# Altium project PCB_Project.PrjPcb
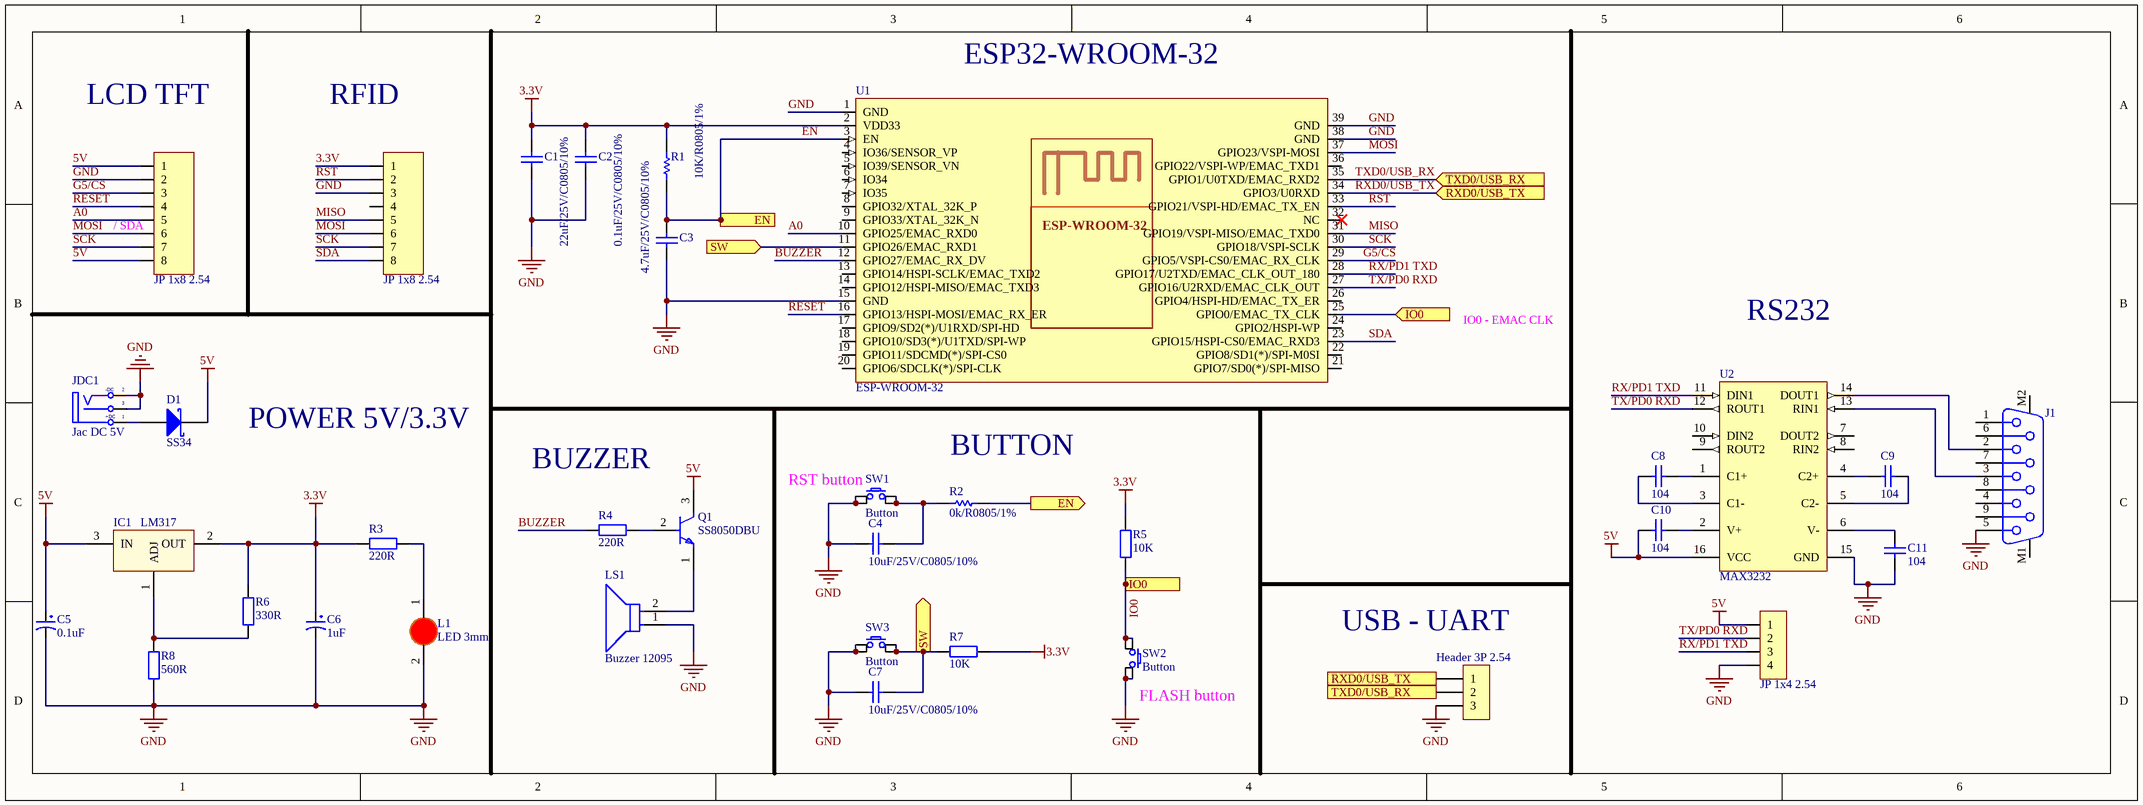
[diagram p0: Sheet1.SchDoc]
1 sheet, 35 parts. Net scope: flat (ports and power ports of the same name join across sheets).
Board file: PCB1.PcbDoc

## Sheet Sheet1.SchDoc
size 401 x 149 mm; SheetNumber: 1; SheetTotal: 1

### Parts
C1  22uF/25V/C0805/10%  [CAP_CERA_C2012(CC0805INCH)]
C2  0.1uF/25V/C0805/10%  [CAP_CERA_C2012(CC0805INCH)]
C3  4.7uF/25V/C0805/10%  [CAP_CERA_C2012(CC0805INCH)]
C4  10uF/25V/C0805/10%  [CAP_CERA_C2012(CC0805INCH)]
C5  0.1uF  [CP1/2]
C6  1uF  [CP1/2]
C7  10uF/25V/C0805/10%  [CAP_CERA_C2012(CC0805INCH)]
C8  104  [tu 0805]
C9  104  [tu 0805]
C10  104  [tu 0805]
C11  104  [tu 0805]
D1  SS34  [SS14]
H1  Header 3P 2.54  [XH2.54M-3]
IC1  LM317  [QTO-220]
J1  618009231321  [618009231321]  (value not drawn)
JDC1  Jac DC 5V  [DC-IN]
JP1  JP 1x8 2.54  [JP 1x8 DT]
JP2  JP 1x8 2.54  [JP 1x8 DT]
JP3  JP 1x4 2.54  [JP 1x4 CT]
L1  LED 3mm  [LED-3MM-RED]
LS1  Buzzer 12095  [FP-MCKPX-G1203A-K4056-MFG]
Q1  SS8050DBU  [FP-135AN-MFG]
R1  10K/R0805/1%  [Res 0805 SMD]
R2  0k/R0805/1%  [Res 0805 SMD]
R3  220R  [tro vach 1/4w]
R4  220R  [tro vach 1/4w]
R5  10K  [tro vach 1/4w]
R6  330R  [tro vach 1/4w]
R7  10K  [tro vach 1/4w]
R8  560R  [tro vach 1/4w]
SW1  Button  [SW/4/06MM]
SW2  Button  [SW/4/06MM]
SW3  Button  [SW/4/06MM]
U1  ESP-WROOM-32  [ESP32 WROOM]
U2  MAX3232  [D0016A_N]

### Ports
EN (in, see Sheet1[3C]), EN (out, see Sheet1[3B]), IO0 (in, see Sheet1[4C]), IO0 (out, see Sheet1[4B]), RXD0/USB_TX (in, see Sheet1[4D]), RXD0/USB_TX (out, see Sheet1[5A]), SW (in, see Sheet1[3D]), SW (out, see Sheet1[2B]), TXD0/USB_RX (in, see Sheet1[4D]), TXD0/USB_RX (out, see Sheet1[5A])

### Nets
3.3V: C1.2 C2.2 C6.1 IC1.2(OUT) JP1.1 R1.1 R3.1 R5.2 R6.2 R7.1 U1.2(VDD33)
5V: C5.1 C10.1 D1.2(K) IC1.3(IN) JP2.1 JP2.8 JP3.1 Q1.3(C) U2.16(VCC)
GND: C1.1 C2.1 C3.1 C4.2 C5.2 C6.2 C7.2 C11.1 H1.3 J1.5 JDC1.2(TN) JDC1.3(S) JP1.3 JP2.2 JP3.4 L1.2(K) LS1.1(C) R8.1 SW1.1 SW1.2 SW2.3 SW2.4 SW3.1 SW3.2 U1.1(GND) U1.15(GND) U1.38(GND) U1.39(GND) U2.15(GND)
A0: JP2.5 U1.10(GPIO25/EMAC_RXD0)
BUZZER: R4.1 U1.12(GPIO27/EMAC_RX_DV)
EN: C3.2 R1.2 R2.2 U1.3(EN) ; port EN
G5/CS: JP2.3 U1.29(GPIO5/VSPI-CS0/EMAC_RX_CLK)
IO0: R5.1 SW2.1 SW2.2 U1.25(GPIO0/EMAC_TX_CLK) ; port IO0
MISO: JP1.5 U1.31(GPIO19/VSPI-MISO/EMAC_TXD0)
MOSI: JP1.6 JP2.6 U1.37(GPIO23/VSPI-MOSI)
RESET: JP2.4 U1.16(GPIO13/HSPI-MOSI/EMAC_RX_ER)
RST: JP1.2 U1.33(GPIO21/VSPI-HD/EMAC_TX_EN)
RX/PD1 TXD: JP3.3 U1.28(GPIO17/U2TXD/EMAC_CLK_OUT_180) U2.11(DIN1)
RXD0/USB_TX: H1.1 U1.34(GPIO3/U0RXD) ; port RXD0/USB_TX
SCK: JP1.7 JP2.7 U1.30(GPIO18/VSPI-SCLK)
SDA: JP1.8 U1.23(GPIO15/HSPI-CS0/EMAC_RXD3)
TX/PD0 RXD: JP3.2 U1.27(GPIO16/U2RXD/EMAC_CLK_OUT) U2.12(ROUT1)
TXD0/USB_RX: H1.2 U1.35(GPIO1/U0TXD/EMAC_RXD2) ; port TXD0/USB_RX
NetC4_1: C4.1 R2.1 SW1.3 SW1.4
NetC7_1: C7.1 R7.2 SW3.3 SW3.4 U1.11(GPIO26/EMAC_RXD1) ; port SW
NetC8_1: C8.1 U2.1(C1+)
NetC8_2: C8.2 U2.3(C1-)
NetC9_1: C9.1 U2.5(C2-)
NetC9_2: C9.2 U2.4(C2+)
NetC10_2: C10.2 U2.2(V+)
NetC11_2: C11.2 U2.6(V-)
NetD1_1: D1.1(A) JDC1.1(T)
NetIC1_1: IC1.1(ADJ) R6.1 R8.2
NetJ1_2: J1.2 U2.14(DOUT1)
NetJ1_3: J1.3 U2.13(RIN1)
NetL1_1: L1.1(A) R3.2
NetLS1_2: LS1.2(A) Q1.1(E)
NetQ1_2: Q1.2(B) R4.2

Not connected (* = marked no-connect by the designer): J1 1 4 6 7 8 9 M1 M2; JP1 4; U1 4(IO36/SENSOR_VP) 5(IO39/SENSOR_VN) 6(IO34) 7(IO35) 8(GPIO32/XTAL_32K_P) 9(GPIO33/XTAL_32K_N) 13(GPIO14/HSPI-SCLK/EMAC_TXD2) 14(GPIO12/HSPI-MISO/EMAC_TXD3) 17(GPIO9/SD2(*)/U1RXD/SPI-HD) 18(GPIO10/SD3(*)/U1TXD/SPI-WP) 19(GPIO11/SDCMD(*)/SPI-CS0) 20(GPIO6/SDCLK(*)/SPI-CLK) 21(GPIO7/SD0(*)/SPI-MISO) 22(GPIO8/SD1(*)/SPI-M0SI) 24(GPIO2/HSPI-WP) 26(GPIO4/HSPI-HD/EMAC_TX_ER) 32(NC)* 36(GPIO22/VSPI-WP/EMAC_TXD1); U2 7(DOUT2) 8(RIN2) 9(ROUT2) 10(DIN2)

### Notes on the sheet
- (near U1) ESP32-WROOM-32
- LCD TFT
- RFID
- (near JP2) / SDA
- IO0 - EMAC CLK
- RS232
- POWER 5V/3.3V
- BUZZER
- (near SW1) RST button
- BUTTON
- (near H1) USB - UART
- (near SW2) FLASH button
- (in symbol DCIN) -DC; +DC

### Library data of the parts
C1 = 0.1uF/50V/C0603/10%: 22µF ±20% 25V Ceramic Capacitor X5R 0805 (2012 Metric); Manufacturer: Tariff Applied; ComponentLink1URL: http://www.murata.com/~/media/webrenewal/support/library/catalog/products/capacitor/mlcc/c02e.ashx; ComponentLink1Description: http://www.murata.com/~/media/webrenewal/support/library/catalog/products/capacitor/mlcc/c02e.ashx; Digikey: 1276-2908-1-ND
C2-C4 C7 = 0.1uF/50V/C0603/10%: 0.1µF ±10% 25V Ceramic Capacitor X7R 0805 (2012 Metric); ComponentLink1URL: http://www.murata.com/~/media/webrenewal/support/library/catalog/products/capacitor/mlcc/c02e.ashx; ComponentLink1Description: http://www.murata.com/~/media/webrenewal/support/library/catalog/products/capacitor/mlcc/c02e.ashx; Digikey: 478-3755-1-ND
C5 C6 = CP1: Cap P  0,1uF < 22uF , 16 - 50V; Value: 10uF/50V; Description 1: 10 => 220uF/6,3V/10V - 10uF => 100uF/16V; Description 2: 0,1uF => 33uF/50V - 10uF => 22uF/63V; Description 3: 0,47uF => 10uF/100V
C8-C11 = Tu 0805 104 50V 10%: Dán; Don_Vi: Con; So_Chan: 2; Ten_Linh_Kien: Tụ 0805 104-100nF 10% 50V; Ma_Hang: MH004551; Chung_Loai: Dán; Kieu_Chan: *
D1 = D Schottky: Schottky Diode; Published: 8-Jun-2000; LatestRevisionDate: 17-Jul-2002; LatestRevisionNote: Re-released for DXP Platform.; PackageReference: SMB; Publisher: Altium Limited; PackageDescription: DO-214-AA/SMB; 2 C-Bend Leads; Body 5.3 x 3.6 mm, inc. leads (LxW); Code_JEDEC: DO-214-AA
H1 = Header 3P 2.54 Duc Thang: Cắm; Ten_Linh_Kien: Header 3P XH2.54-3P Đực Thẳng; Don_Vi: Con; Ma_Hang: MH001292; Chung_Loai: Cắm
IC1 = LM317: Adj Voltage +1.2 -> +37V; Value: LM317
J1 = CMP-1502-00204-2: NexarPartId: 12259390; Contact Resistance: 30mΩ; Current Rating: 3A; Insulation Resistance: 5GΩ; Voltage Rating: 125V; Pitch: 2.77mm; Gender: Female; Number of Contacts: 9; Number of Rows: 2; Insulation Material: PBT; Orientation: Right Angle; Termination: SMD/SMT; Min Operating Temperature: -55°C; RoHS: Compliant; Max Operating Temperature: 105°C; Lead Free: Lead Free; Housing Material: Steel; Number of Pins: 9; Depth: 20.75mm; Contact Plating: Gold; Width: 12.5mm; Operating Supply Voltage: 125V; REACH SVHC: Unknown; Mount: Through Hole; Length: 16.34mm
JDC1 = DCIN: Jac DC input; Value: Jac DC
JP1 JP2 = JP 1x8 2.54 Duc Thang: Cắm; Ten_Linh_Kien: Jump Đơn Đực 2.54MM 1x40P Thẳng 11MM; Don_Vi: Con; Ma_Hang: MH000903; Ghi_Chu: *; Kieu_Chan: *; Chung_Loai: Cắm
JP3 = JP 1x4 2.54 Cai Thang: Cắm; Ten_Linh_Kien: Jump Đơn Cái 2.54MM 1x20P Thẳng; Don_Vi: Con; Ma_Hang: MH004006; Ghi_Chu: *; Kieu_Chan: *; Chung_Loai: Cắm
L1 = LED 3mm Do: Cắm; Don_Vi: Con; Ma_Hang: MH003892; Ten_Linh_Kien: Led 3MM Phủ Đỏ (10c); Ghi_Chu: *; Kieu_Chan: *; Chung_Loai: Cắm
LS1 = CMP-12433-000001-1: MAGNETIC BUZZER AND TRANSDUCER - More Details; Manufacturer Part Number: MCKPX-G1203A-K4056; Manufacturer: Multicomp Pro; Operating Supply Voltage: 3V; Current: 30mA; Frequency: 2300Hz; Max Supply Voltage: 5V; Min Supply Voltage: 2V; Standoff Height: 0.5mm; ComponentLink2Description: Datasheet; ComponentLink2URL: http://www.farnell.com/datasheets/1498149.pdf?_ga=2.17855225.1157923166.1572356775-536200964.1569240579; Temperature Range High: +70°C; Device Class L2: Audio Products; Temperature Range Low: -20°C; Package: 0; Temperature: -20°C to +70°C; Category: Speak; Octopart: https://octopart.com/mckpx-g1203a-k4056-multicomp-12157154; RoHS: TRUE; Lead Free: Yes; Height: 9.5mm; Device Class L1: Electromechanical; Automotive: No; Device Class L3: Buzzers
Q1 = CMP-00278-84331634-1: SS8050DBU Bipolar (BJT) Single Transistor, NPN, 25 V, 100 MHz, 1 W, 1.5 A, 160; Manufacturer Lifecycle Status: ACTIVE; Collector Base Voltage (VCBO): 40V; Power Dissipation: 1W; Max Junction Temperature (Tj): 150°C; Frequency: 100MHz; Output Power: 2W; Collector Emitter Voltage (VCEO): 25V; Max Collector Current: 1.5A; Collector Emitter Saturation Voltage: 500mV; Number of Elements: 1; Emitter Base Voltage (VEBO): 6V; hFE Min: 85; RoHS: Compliant; Lifecycle Status: Production; Lead Free: Lead Free; Transition Frequency: 100MHz; Case/Package: TO-92; Width: 3.86mm; Min Operating Temperature: -65°C; Element Configuration: Single; Gain Bandwidth Product: 100MHz; REACH SVHC: No SVHC; Max Frequency: 100MHz; Radiation Hardening: No; Current Rating: 1.5A; Mount: Through Hole; Max Operating Temperature: 150°C; Polarity: NPN; Number of Pins: 3; Collector Emitter Breakdown Voltage: 25V; Schedule B: 8541290080, 8541290080|8541290080|8541290080|8541290080|8541290080; Packaging: Bulk; Weight: 179mg; NexarPartId: 84331634; Voltage Rating (DC): 25V; Max Power Dissipation: 1W; Height: 4.58mm; Length: 4.58mm
R1 = 200K/R0603/1%: 10 kOhms ±1% 0.125W, 1/8W Chip Resistor 0805 (2012 Metric) Thick Film; Power (Watts): 0.1W, 1/10W; RoHS: RoHS Compliant; Category: Resistors; Part Status: Active; Features: Moisture Resistant; Operating Temperature: -55°C ~ 155°C; Package / Case: 0603 (1608 Metric); Supplier Device Package: 0603; Size / Dimension: 0.063" L x 0.031" W (1.60mm x 0.80mm); Height - Seated (Max): 0.022" (0.55mm); Failure Rate: -; ComponentLink1URL: http://www.yageo.com/documents/recent/PYu-RC_Group_51_RoHS_L_7.pdf; ComponentLink1Description: http://www.yageo.com/documents/recent/PYu-RC_Group_51_RoHS_L_7.pdf; Digikey: A126332CT-ND
R2 = 200K/R0603/1%: 0 Ohms Jumper 0.125W, 1/8W Chip Resistor 0805 (2012 Metric) Automotive AEC-Q200 Thick Film; Part Status: Active; Height - Seated (Max): 0.022" (0.55mm); Failure Rate: -; ComponentLink1URL: http://www.yageo.com/documents/recent/PYu-RC_Group_51_RoHS_L_7.pdf; ComponentLink1Description: http://www.yageo.com/documents/recent/PYu-RC_Group_51_RoHS_L_7.pdf; Digikey: 541-0.0ACT-ND
R3-R8 = Tro Vach 1/4W 5% 220R: Cắm; Don_Vi: Con; So_Chan: 2; Ten_Linh_Kien: Trở Vạch 1/4w 5% 220R; Ma_Hang: MH007300; Chung_Loai: Cắm; Kieu_Chan: *
SW1-SW3 = SW SPST 4-pin: Tact switch 4-pin
U1 = ESP-WROOM-32: ESP-WROOM-32 (8MB), WIFI MODULE 64 MBITS SPI FLASH; Digikey: 1904-1019-1-ND
U2 = CMP-0299-00792-2: 3-V to 5.5-V Multichannel RS-232 Line Driver / Receiver with ±15-kV IEC ESD Protection, -40 to 85 degC, 16-Pin SOIC (D), Green (RoHS & no Sb/Br); Drivers Per Package: 2; IEC-61000-4-2 SUPPORT: TRUE; Supply Voltage(s)(V): 3.3 or 5.0; ICC(Max)(mA): 1; ESD HBM(kV): +/-15; PackageVersion: revM, Jun-2011; ComponentLink2URL: http://www.ti.com/general/docs/lit/getliterature.tsp?genericPartNumber=MAX3232E&fileType=pdf; PackageReference: D0016A; DatasheetVersion: SLLS664A; ComponentLink3Description: Package Specification; PackageDescription: 16-Pin Plastic Small Outline Integrated Circuit, 9.9 x 3.9 mm, Pitch 1.27 mm Pitch; SubFamily: RS-232; Single Supply: TRUE; RS-232: TRUE; ComponentLink1Description: Manufacturer URL; ComponentLink1URL: www.ti.com; ComponentLink3URL: http://www.ti.com/litv/pdf/mpds178g; Receivers Per Package: 2; ComponentLink2Description: Datasheet